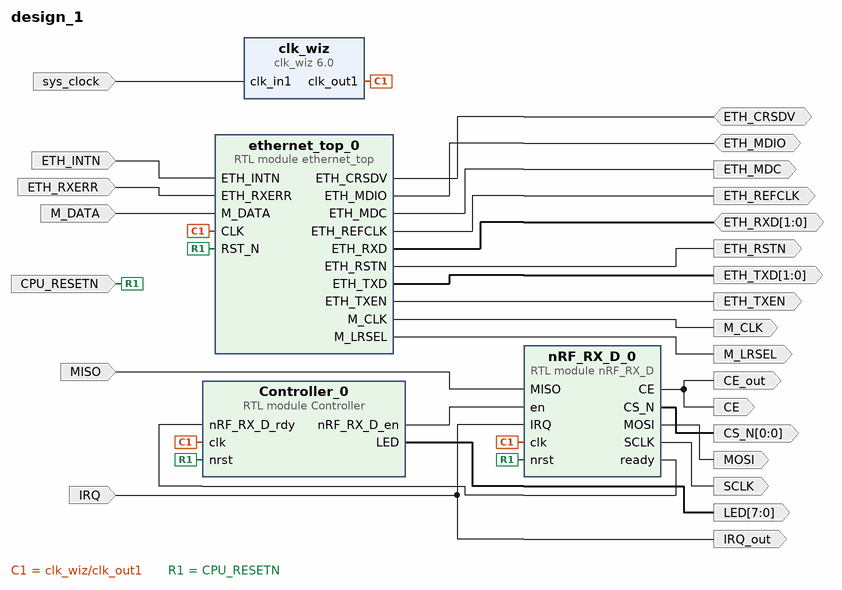
[diagram p0: block diagram of the top level]
# Vivado block design design_1, xc7a100tcsg324-1, Vivado 2022.1
create_bd_design design_1

create_bd_port -dir I M_DATA
create_bd_port -dir O -type clk M_CLK
create_bd_port -dir O M_LRSEL
create_bd_port -dir I -type clk sys_clock
set_property -dict {CONFIG.FREQ_HZ 100000000 CONFIG.PHASE 0.000} [get_bd_ports sys_clock]
create_bd_port -dir I -type rst CPU_RESETN
create_bd_port -dir O -from 7 -to 0 LED
create_bd_port -dir O CE
create_bd_port -dir O -from 0 -to 0 CS_N
create_bd_port -dir I -type intr IRQ
create_bd_port -dir I MISO
create_bd_port -dir O MOSI
create_bd_port -dir O SCLK
create_bd_port -dir O IRQ_out
create_bd_port -dir O CE_out
create_bd_port -dir IO ETH_CRSDV
create_bd_port -dir I ETH_INTN
create_bd_port -dir O ETH_MDC
create_bd_port -dir IO ETH_MDIO
create_bd_port -dir O ETH_REFCLK
create_bd_port -dir O -type rst ETH_RSTN
create_bd_port -dir IO -from 1 -to 0 ETH_RXD
create_bd_port -dir I ETH_RXERR
create_bd_port -dir O -from 1 -to 0 ETH_TXD
create_bd_port -dir O ETH_TXEN

create_bd_cell -type module -reference Controller Controller_0
create_bd_cell -type module -reference nRF_RX_D nRF_RX_D_0
create_bd_cell -type ip -vlnv xilinx.com:ip:clk_wiz:6.0 clk_wiz
set_property -dict [list \
  CONFIG.CLK_IN1_BOARD_INTERFACE sys_clock \
  CONFIG.USE_BOARD_FLOW true \
  CONFIG.USE_LOCKED false \
  CONFIG.USE_RESET false \
] [get_bd_cells clk_wiz]
create_bd_cell -type module -reference ethernet_top ethernet_top_0

# ---- connections ----

connect_bd_net [get_bd_pins Controller_0/LED] [get_bd_ports LED]
connect_bd_net [get_bd_pins Controller_0/nRF_RX_D_en] [get_bd_pins nRF_RX_D_0/en]
connect_bd_net -net ETH_INTN_0_1 [get_bd_ports ETH_INTN] [get_bd_pins ethernet_top_0/ETH_INTN]
connect_bd_net -net ETH_RXERR_0_1 [get_bd_ports ETH_RXERR] [get_bd_pins ethernet_top_0/ETH_RXERR]
connect_bd_net -net IRQ_0_1 [get_bd_ports IRQ] [get_bd_pins nRF_RX_D_0/IRQ] [get_bd_ports IRQ_out]
connect_bd_net -net MISO_0_1 [get_bd_ports MISO] [get_bd_pins nRF_RX_D_0/MISO]
connect_bd_net [get_bd_ports M_DATA] [get_bd_pins ethernet_top_0/M_DATA]
connect_bd_net [get_bd_pins clk_wiz/clk_out1] [get_bd_pins Controller_0/clk] [get_bd_pins nRF_RX_D_0/clk] [get_bd_pins ethernet_top_0/CLK]
connect_bd_net [get_bd_ports CPU_RESETN] [get_bd_pins Controller_0/nrst] [get_bd_pins nRF_RX_D_0/nrst] [get_bd_pins ethernet_top_0/RST_N]
connect_bd_net [get_bd_ports ETH_CRSDV] [get_bd_pins ethernet_top_0/ETH_CRSDV]
connect_bd_net [get_bd_ports ETH_MDIO] [get_bd_pins ethernet_top_0/ETH_MDIO]
connect_bd_net [get_bd_ports ETH_RXD] [get_bd_pins ethernet_top_0/ETH_RXD]
connect_bd_net [get_bd_pins ethernet_top_0/ETH_MDC] [get_bd_ports ETH_MDC]
connect_bd_net [get_bd_pins ethernet_top_0/ETH_REFCLK] [get_bd_ports ETH_REFCLK]
connect_bd_net [get_bd_pins ethernet_top_0/ETH_RSTN] [get_bd_ports ETH_RSTN]
connect_bd_net [get_bd_pins ethernet_top_0/ETH_TXD] [get_bd_ports ETH_TXD]
connect_bd_net [get_bd_pins ethernet_top_0/ETH_TXEN] [get_bd_ports ETH_TXEN]
connect_bd_net [get_bd_pins nRF_RX_D_0/CE] [get_bd_ports CE] [get_bd_ports CE_out]
connect_bd_net [get_bd_pins nRF_RX_D_0/CS_N] [get_bd_ports CS_N]
connect_bd_net [get_bd_pins nRF_RX_D_0/MOSI] [get_bd_ports MOSI]
connect_bd_net [get_bd_pins nRF_RX_D_0/SCLK] [get_bd_ports SCLK]
connect_bd_net [get_bd_pins nRF_RX_D_0/ready] [get_bd_pins Controller_0/nRF_RX_D_rdy]
connect_bd_net -net pdm_microphone_0_M_CLK [get_bd_pins ethernet_top_0/M_CLK] [get_bd_ports M_CLK]
connect_bd_net -net pdm_microphone_0_M_LRSEL [get_bd_pins ethernet_top_0/M_LRSEL] [get_bd_ports M_LRSEL]
connect_bd_net [get_bd_ports sys_clock] [get_bd_pins clk_wiz/clk_in1]

validate_bd_design
save_bd_design
